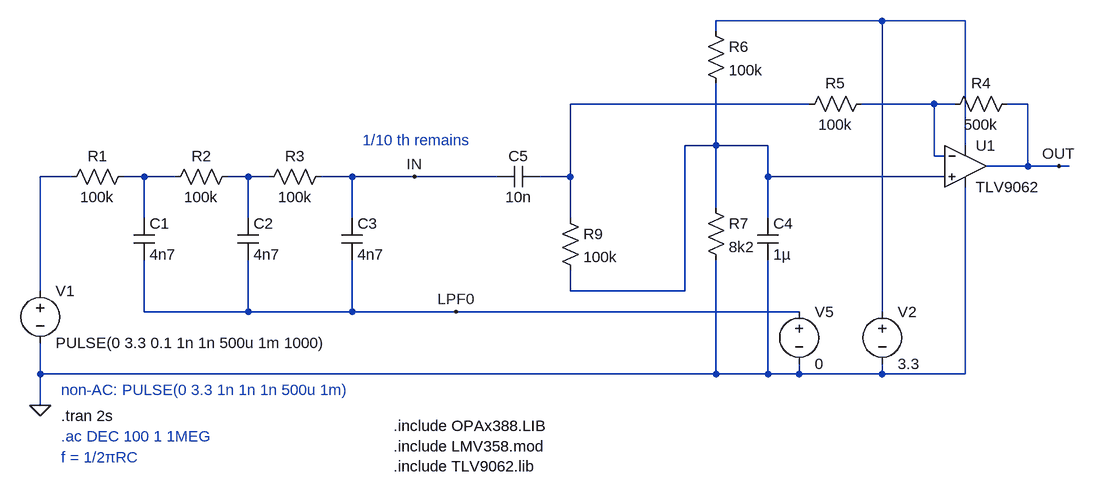
[diagram p0: schematic sinewavesimple.asc]
sinewavesimple.asc, the LTspice schematic file:
Version 4
SHEET 1 4412 8944
WIRE 1376 -48 1120 -48
WIRE 1504 -48 1376 -48
WIRE 1120 -32 1120 -48
WIRE 1264 80 896 80
WIRE 1456 80 1344 80
WIRE 1488 80 1456 80
WIRE 1600 80 1568 80
WIRE 1120 144 1120 48
WIRE 1120 144 1072 144
WIRE 1200 144 1120 144
WIRE 1504 144 1504 -48
WIRE 1456 160 1456 80
WIRE 1472 160 1456 160
WIRE 1600 176 1600 80
WIRE 1600 176 1536 176
WIRE 1648 176 1600 176
WIRE 1664 176 1648 176
WIRE 128 192 80 192
WIRE 240 192 208 192
WIRE 288 192 240 192
WIRE 400 192 368 192
WIRE 432 192 400 192
WIRE 560 192 512 192
WIRE 656 192 560 192
WIRE 784 192 656 192
WIRE 896 192 896 80
WIRE 896 192 848 192
WIRE 1200 192 1200 144
WIRE 1472 192 1200 192
WIRE 1120 240 1120 144
WIRE 240 256 240 192
WIRE 400 256 400 192
WIRE 560 256 560 192
WIRE 896 256 896 192
WIRE 1200 256 1200 192
WIRE 80 368 80 192
WIRE 896 368 896 336
WIRE 1072 368 1072 144
WIRE 1072 368 896 368
WIRE 240 400 240 320
WIRE 400 400 400 320
WIRE 400 400 240 400
WIRE 560 400 560 320
WIRE 560 400 400 400
WIRE 720 400 560 400
WIRE 1248 400 720 400
WIRE 1376 400 1376 -48
WIRE 80 496 80 448
WIRE 1120 496 1120 320
WIRE 1120 496 80 496
WIRE 1200 496 1200 320
WIRE 1200 496 1120 496
WIRE 1248 496 1248 480
WIRE 1248 496 1200 496
WIRE 1376 496 1376 480
WIRE 1376 496 1248 496
WIRE 1504 496 1504 208
WIRE 1504 496 1376 496
WIRE 80 544 80 496
FLAG 80 544 0
FLAG 720 400 LPF0
FLAG 656 192 IN
FLAG 1648 176 OUT
SYMBOL voltage 80 352 R0
SYMATTR InstName V1
SYMATTR Value PULSE(0 3.3 0.1 1n 1n 500u 1m 1000)
SYMATTR Value2 AC 1
SYMBOL res 224 176 R90
WINDOW 0 0 56 VBottom 2
WINDOW 3 32 56 VTop 2
SYMATTR InstName R1
SYMATTR Value 100k
SYMBOL res 384 176 R90
WINDOW 0 0 56 VBottom 2
WINDOW 3 32 56 VTop 2
SYMATTR InstName R2
SYMATTR Value 100k
SYMBOL res 528 176 R90
WINDOW 0 0 56 VBottom 2
WINDOW 3 32 56 VTop 2
SYMATTR InstName R3
SYMATTR Value 100k
SYMBOL cap 224 256 R0
SYMATTR InstName C1
SYMATTR Value 4n7
SYMBOL cap 384 256 R0
SYMATTR InstName C2
SYMATTR Value 4n7
SYMBOL cap 544 256 R0
SYMATTR InstName C3
SYMATTR Value 4n7
SYMBOL voltage 1248 384 R0
SYMATTR InstName V5
SYMATTR Value 0
SYMBOL OpAmps/opamp2 1504 112 R0
SYMATTR InstName U1
SYMATTR Value TLV9062
SYMBOL voltage 1376 384 R0
SYMATTR InstName V2
SYMATTR Value 3.3
SYMBOL res 1584 64 R90
WINDOW 0 0 56 VBottom 2
WINDOW 3 32 56 VTop 2
SYMATTR InstName R4
SYMATTR Value 500k
SYMBOL res 1360 64 R90
WINDOW 0 0 56 VBottom 2
WINDOW 3 32 56 VTop 2
SYMATTR InstName R5
SYMATTR Value 100k
SYMBOL res 1104 -48 R0
SYMATTR InstName R6
SYMATTR Value 100k
SYMBOL res 1104 224 R0
SYMATTR InstName R7
SYMATTR Value 8k2
SYMBOL cap 1184 256 R0
SYMATTR InstName C4
SYMATTR Value 1µ
SYMBOL cap 848 176 R90
WINDOW 0 0 32 VBottom 2
WINDOW 3 32 32 VTop 2
SYMATTR InstName C5
SYMATTR Value 10n
SYMBOL res 880 240 R0
SYMATTR InstName R9
SYMATTR Value 100k
TEXT 112 560 Left 2 !.tran 2s
TEXT 576 136 Left 2 ;1/10 th remains
TEXT 112 624 Left 2 ;f = 1/2πRC
TEXT 624 576 Left 2 !.include OPAx388.LIB\n.include LMV358.mod\n.include TLV9062.lib
TEXT 112 520 Left 2 ;non-AC: PULSE(0 3.3 1n 1n 1n 500u 1m)
TEXT 112 592 Left 2 ;.ac DEC 100 1 1MEG

The netlist it stands for:
* sinewavesimple.asc
V1 N005 0 PULSE(0 3.3 0.1 1n 1n 500u 1m 1000) AC 1
R1 N006 N005 100k
R2 N007 N006 100k
R3 IN N007 100k
C1 N006 LPF0 4n7
C2 N007 LPF0 4n7
C3 IN LPF0 4n7
V5 LPF0 0 0
XU1 N004 N003 N001 0 OUT TLV9062  ; pins In+ In- V+ V- OUT
V2 N001 0 3.3
R4 OUT N003 500k
R5 N003 N002 100k
R6 N001 N004 100k
R7 N004 0 8k2
C4 N004 0 1µ
C5 N002 IN 10n
R9 N002 N004 100k
.tran 2s
* 1/10 th remains
* f = 1/2πRC
.include OPAx388.LIB
.include LMV358.mod
.include TLV9062.lib
* non-AC: PULSE(0 3.3 1n 1n 1n 500u 1m)
* .ac DEC 100 1 1MEG
.backanno
.end